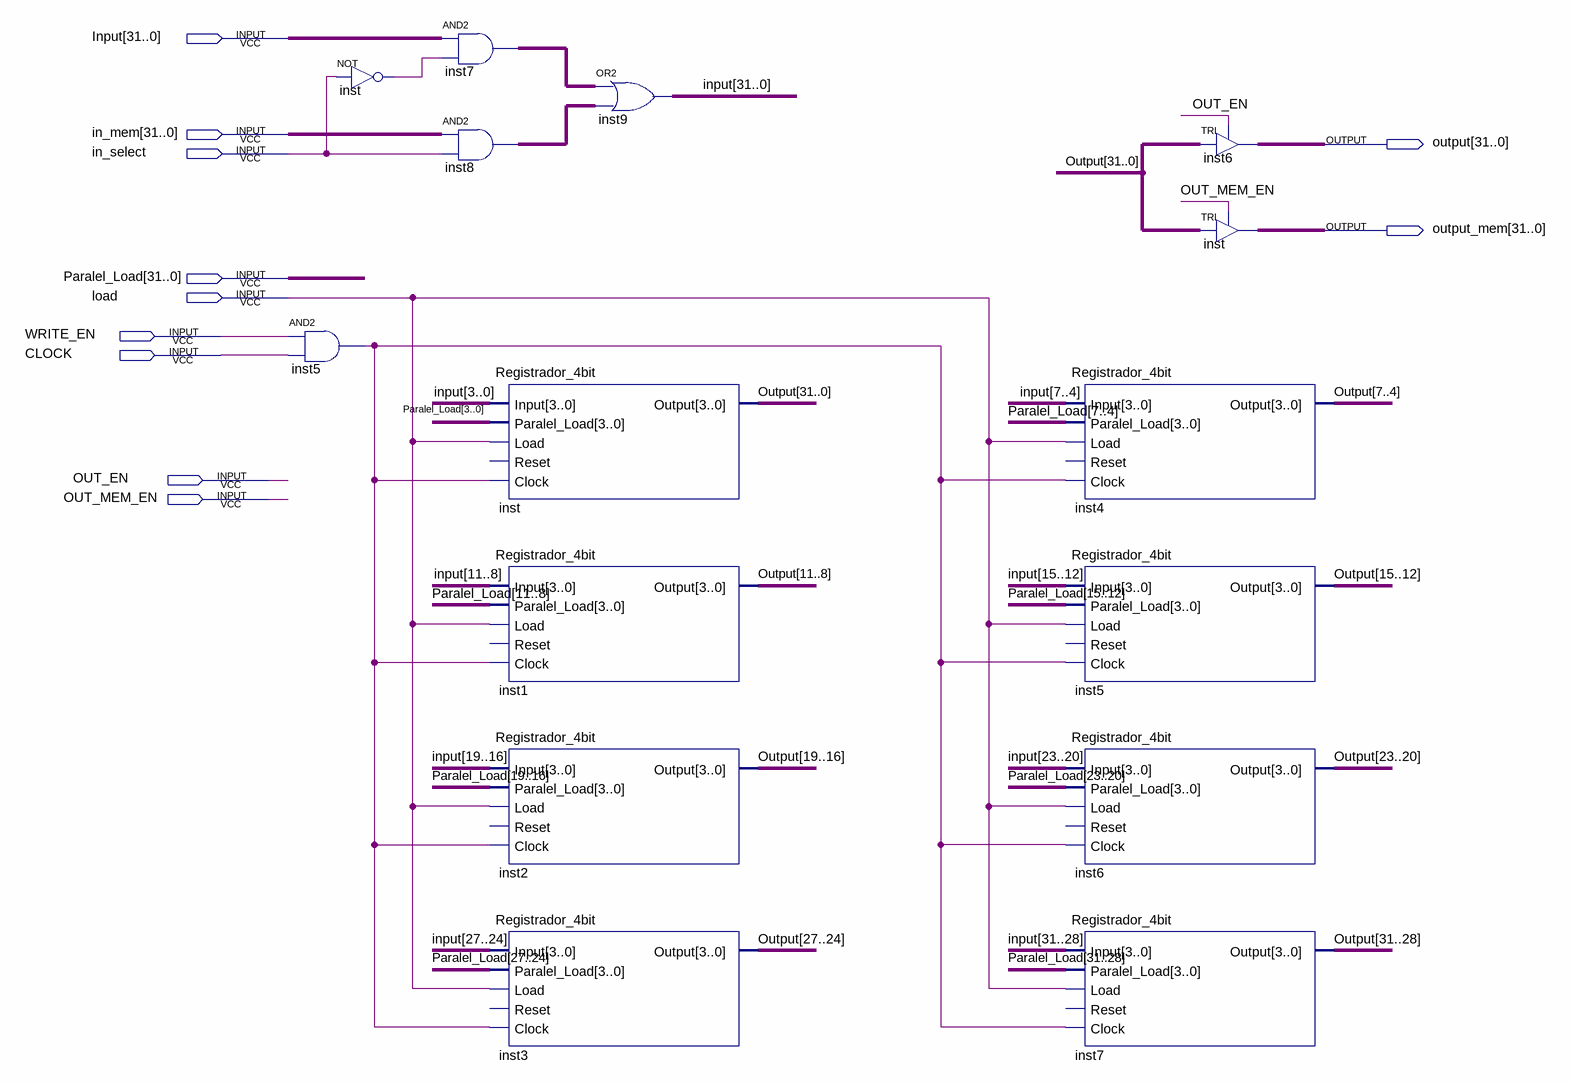
[diagram p0: schematic sheet]
// Quartus schematic Registrador_32bit.bdf as structural Verilog: 15 symbols, 11 pins
module Registrador_32bit (
  input  [31:0] Input,
  input  [31:0] in_mem,
  input  in_select,
  input  [31:0] Paralel_Load,
  input  load,
  input  WRITE_EN,
  input  CLOCK,
  input  OUT_EN,
  input  OUT_MEM_EN,
  output [31:0] \output ,
  output [31:0] output_mem
);

  wire inst5_out, inst_out;
  wire [31:0] inst7_out, inst8_out;

  and inst5 (inst5_out, WRITE_EN, CLOCK);
  not inst (inst_out, in_select);
  assign inst7_out = Input & {32{inst_out}};  // AND2 inst7, 32 bits wide
  assign inst8_out = in_mem & {32{in_select}};  // AND2 inst8, 32 bits wide
  Registrador_4bit inst_dup2 (
    .Input(Input[3:0]), .Paralel_Load(Paralel_Load[3:0]), .Load(load), .Clock(inst5_out), .Output(\output ));  // open: Reset
  Registrador_4bit inst1 (
    .Input(Input[11:8]), .Paralel_Load(Paralel_Load[11:8]), .Load(load), .Clock(inst5_out),
    .Output(\output [11:8]));  // open: Reset
  Registrador_4bit inst2 (
    .Input(Input[19:16]), .Paralel_Load(Paralel_Load[19:16]), .Load(load), .Clock(inst5_out),
    .Output(\output [19:16]));  // open: Reset
  Registrador_4bit inst3 (
    .Input(Input[27:24]), .Paralel_Load(Paralel_Load[27:24]), .Load(load), .Clock(inst5_out),
    .Output(\output [27:24]));  // open: Reset
  assign Input = inst7_out | inst8_out;  // OR2 inst9, 32 bits wide
  Registrador_4bit inst4 (
    .Input(Input[7:4]), .Paralel_Load(Paralel_Load[7:4]), .Load(load), .Clock(inst5_out),
    .Output(\output [7:4]));  // open: Reset
  Registrador_4bit inst5_dup2 (
    .Input(Input[15:12]), .Paralel_Load(Paralel_Load[15:12]), .Load(load), .Clock(inst5_out),
    .Output(\output [15:12]));  // open: Reset
  Registrador_4bit inst6 (
    .Input(Input[23:20]), .Paralel_Load(Paralel_Load[23:20]), .Load(load), .Clock(inst5_out),
    .Output(\output [23:20]));  // open: Reset
  Registrador_4bit inst7_dup2 (
    .Input(Input[31:28]), .Paralel_Load(Paralel_Load[31:28]), .Load(load), .Clock(inst5_out),
    .Output(\output [31:28]));  // open: Reset
  TRI inst6_dup2[31:0] (.IN(\output ), .OE(OUT_EN), .OUT(\output ));
  TRI inst_dup3[31:0] (.IN(\output ), .OE(OUT_MEM_EN), .OUT(output_mem));
endmodule
